# EAGLE design minM3car (EAGLE 9.4.2)
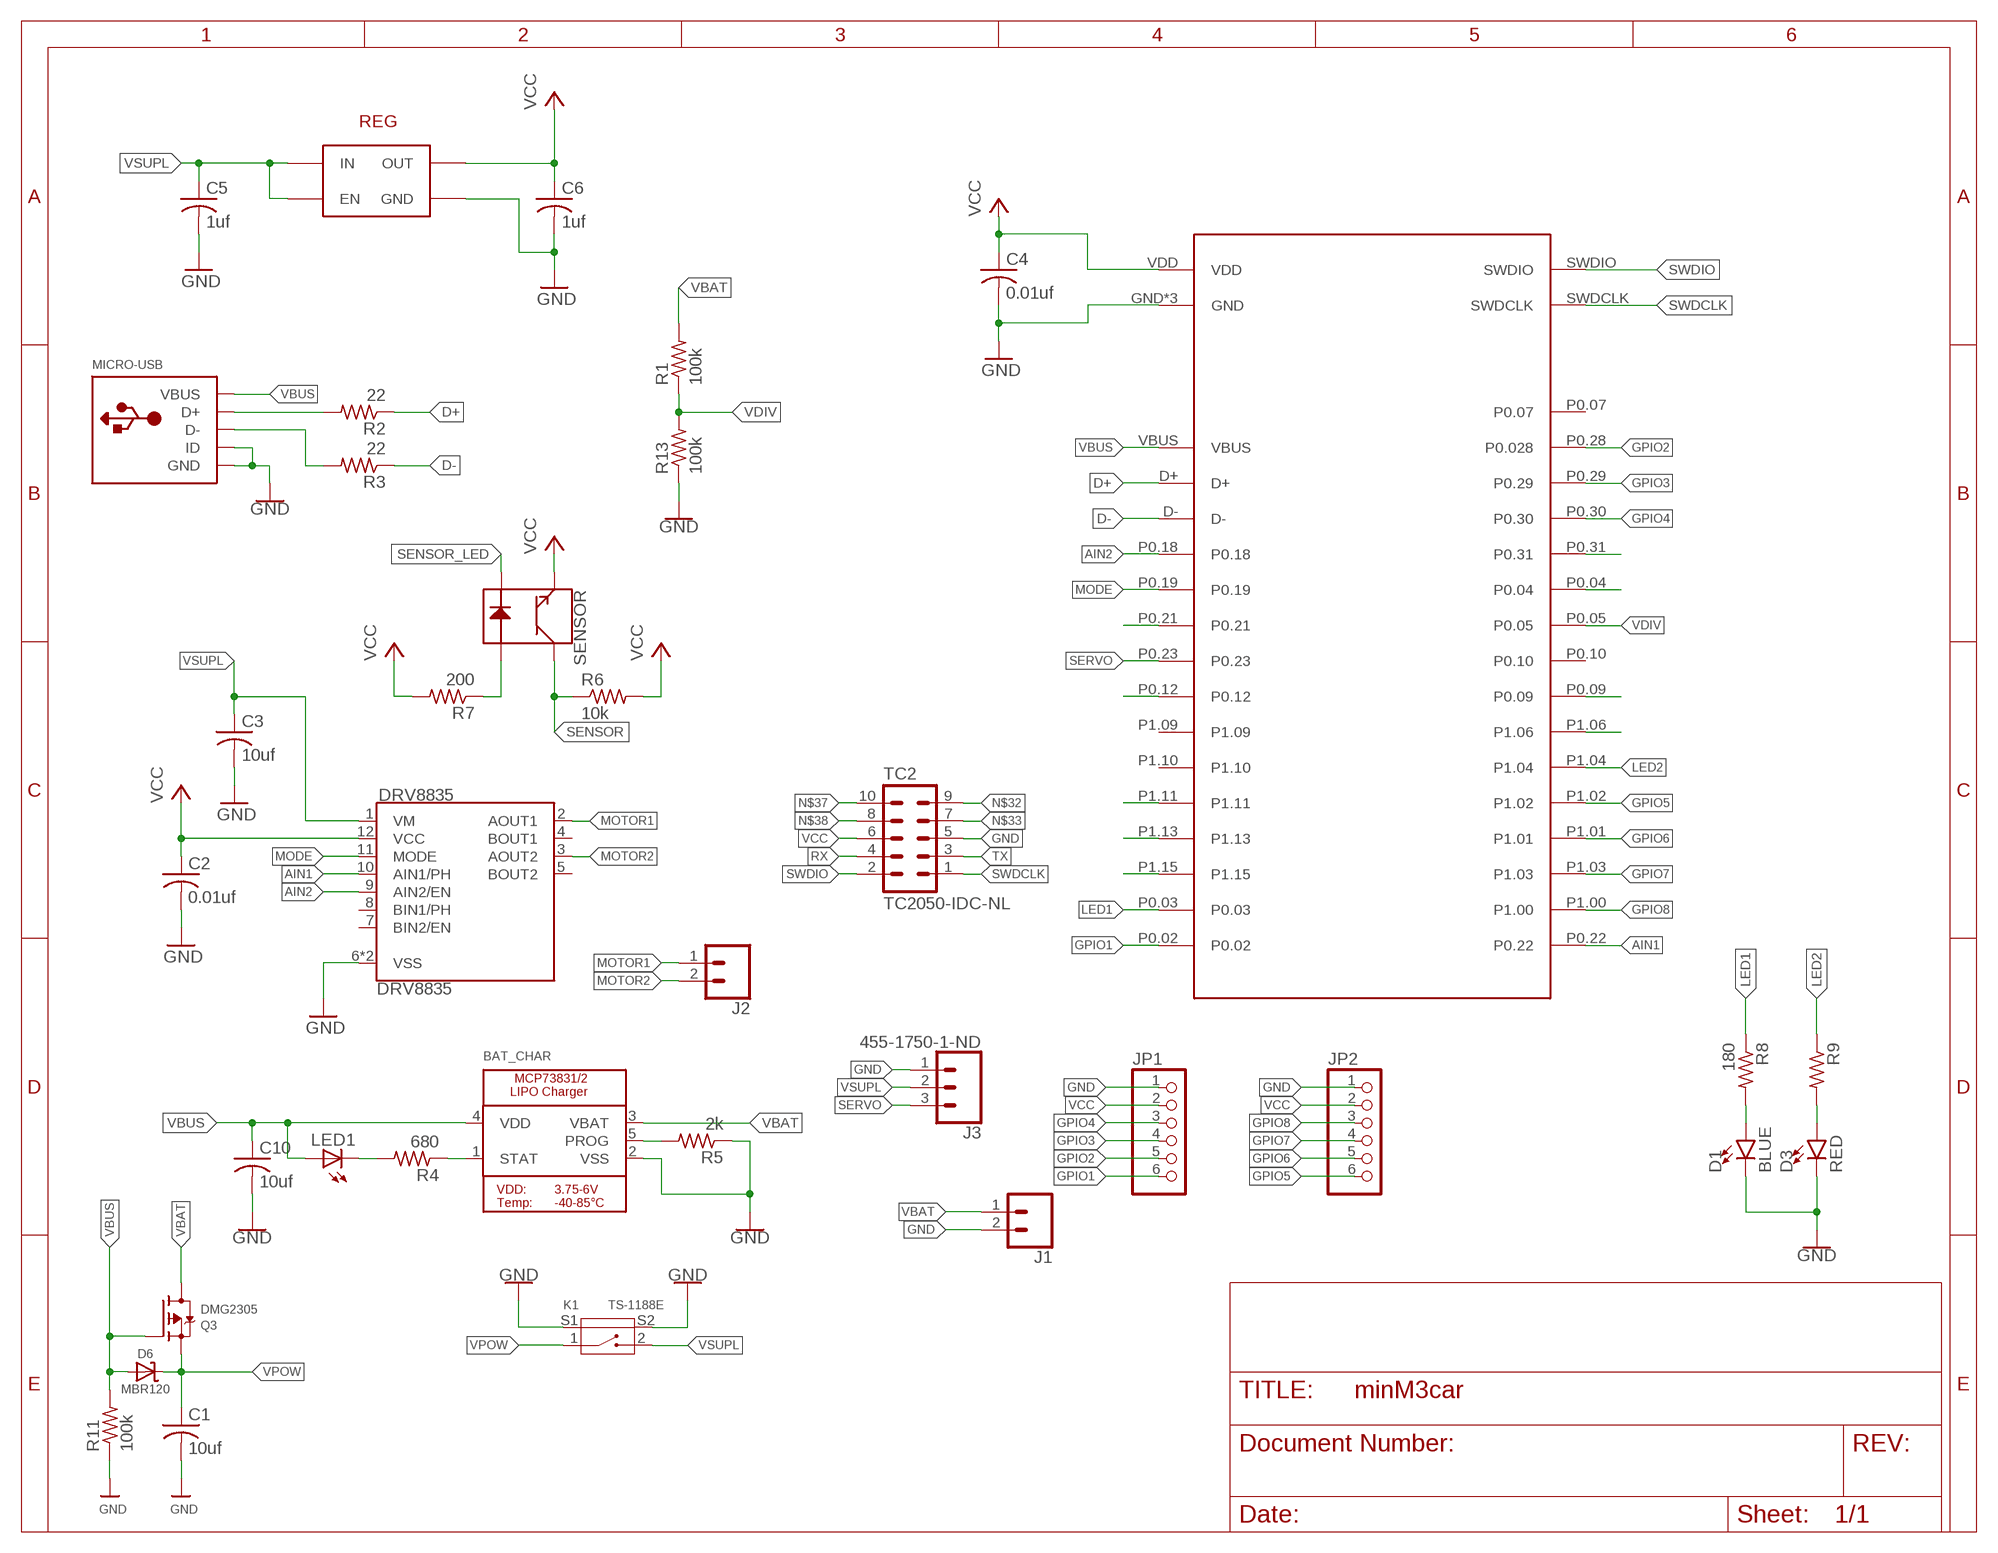
[diagram p0: schematic, sheet 1]

## Parts
BAT_CHAR  MICROBUILDER_MCP73831/2  [MICROBUILDER_SOT23-5]
C1  10uf  C-USC0402  [C0402]
C2  0.01uf  C-USC0402  [C0402]
C3  10uf  C-USC0402  [C0402]
C4  0.01uf  C-USC0402  [C0402]
C5  1uf  C-USC0402  [C0402]
C6  1uf  C-USC0402  [C0402]
C10  10uf  C-USC0402  [C0402]
D1  BLUE  LED-BLUE0603  [LED-0603]
D3  RED  LED-RED0603  [LED-0603]
D6  MBR120  DIODE-SCHOTTKYSOD-123  [SOD-123]
DRV8835  DRV8835  DRV883X  [WSON-12]
J1  CONN_02  [1X02]
J2  CONN_02  [1X02]
J3  455-1750-1-ND  CONN_03  [1X03]
JP1  PINHD-1X6  [1X06]
JP2  PINHD-1X6  [1X06]
K1  TS-1188E  SMD-BUTTON(2+2P-7X3.5MM-90D)  [SW4-SMD-7.0X3.5X3.5MM-90D]
LED1  LEDCHIPLED_0603  [CHIPLED_0603]
MICRO-USB  MICROBUILDER_USB_MICRO_20329_V2  [MICROBUILDER_4UCONN_20329_V2]
NRF52  HOLYIOT  [HOLYIOT]
Q3  DMG2305  MOSFET-P  [SOT23-R]
R1  100k  R-US_R0402  [R0402]
R2  22  R-US_R0402  [R0402]
R3  22  R-US_R0402  [R0402]
R4  680  R-US_R0402  [R0402]
R5  2k  R-US_R0402  [R0402]
R6  10k  R-US_R0402  [R0402]
R7  200  R-US_R0402  [R0402]
R8  180  R-US_R0402  [R0402]
R9  180  R-US_R0402  [R0402]
R11  100k  R-US_R0402  [R0402]
R13  100k  R-US_R0402  [R0402]
REG  TLV703  [SOT95P285X120-5N]
SENSOR  QRE1113SMD-W  [QRE1113-W]
TC2  TC2050-IDC-NL  [TC2050-IDC-NL]

## Nets
AIN1: DRV8835.10(AIN1/PH) NRF52.P0.22
AIN2: DRV8835.9(AIN2/EN) NRF52.P0.18
D+: NRF52.D+ R2.1
D-: NRF52.D- R3.1
GND: BAT_CHAR.2(VSS) C1.2 C2.2 C3.2 C4.2 C5.2 C6.2 C10.2 D1.C D3.C DRV8835.6(VSS) DRV8835.PAD(VSS) J1.2 J3.1 JP1.1 JP2.1 K1.S1 K1.S2 MICRO-USB.BASE@1(GND) MICRO-USB.BASE@2(GND) MICRO-USB.GND MICRO-USB.ID MICRO-USB.SPRT@1(GND) MICRO-USB.SPRT@2(GND) MICRO-USB.SPRT@3(GND) MICRO-USB.SPRT@4(GND) NRF52.GND NRF52.GND2(GND) NRF52.GND3(GND) R5.1 R11.1 R13.1 REG.2(GND) TC2.5
GPIO1: JP1.6 NRF52.P0.02
GPIO2: JP1.5 NRF52.P0.28(P0.028)
GPIO3: JP1.4 NRF52.P0.29
GPIO4: JP1.3 NRF52.P0.30
GPIO5: JP2.6 NRF52.P1.02
GPIO6: JP2.5 NRF52.P1.01
GPIO7: JP2.4 NRF52.P1.03
GPIO8: JP2.3 NRF52.P1.00
LED1: NRF52.P0.03 R8.1
LED2: NRF52.P1.04 R9.1
MODE: DRV8835.11(MODE) NRF52.P0.19
MOTOR1: DRV8835.2(AOUT1) J2.1
MOTOR2: DRV8835.3(AOUT2) J2.2
N$1: D1.A R8.2
N$2: LED1.C R4.2
N$3: D3.A R9.2
N$4 [POWER]: NRF52.P0.21
N$6: NRF52.P0.12
N$7 [POWER]: NRF52.P0.09
N$8: MICRO-USB.D+ R2.2
N$9: MICRO-USB.D- R3.2
N$10 [POWER]: NRF52.P1.06
N$15: R7.1 SENSOR.1(A)
N$19 [POWER]: NRF52.P1.15
N$20: BAT_CHAR.5(PROG) R5.2
N$21: BAT_CHAR.1(STAT) R4.1
N$22 [POWER]: NRF52.P1.13
N$23 [POWER]: NRF52.P1.11
N$27 [POWER]: NRF52.P0.04
N$30 [POWER]: NRF52.P0.31
N$32: TC2.9
N$33: TC2.7
N$37: TC2.10
N$38: TC2.8
RX: TC2.4
SENSOR: R6.1 SENSOR.3(C)
SENSOR_LED: SENSOR.2(K)
SERVO: J3.3 NRF52.P0.23
SWDCLK: NRF52.SWDCLK TC2.1
SWDIO: NRF52.SWDIO TC2.2
TX: TC2.3
VBAT [POWER]: BAT_CHAR.3(VBAT) J1.1 Q3.3(D) R1.2
VBUS [POWER]: BAT_CHAR.4(VDD) C10.1 D6.A LED1.A MICRO-USB.VBUS NRF52.VBUS Q3.1(G) R11.2
VCC [3.3V]: C2.1 C4.1 C6.1 DRV8835.12(VCC) JP1.2 JP2.2 NRF52.VDD R6.2 R7.2 REG.5(OUT) SENSOR.4(E) TC2.6
VDIV: NRF52.P0.05 R1.1 R13.2
VPOW: C1.1 D6.C K1.1 Q3.2(S)
VSUPL [POWER]: C3.1 C5.1 DRV8835.1(VM) J3.2 K1.2 REG.1(IN) REG.3(EN)
Unconnected: DRV8835.4(BOUT1) DRV8835.5(BOUT2) DRV8835.7(BIN2/EN) DRV8835.8(BIN1/PH) NRF52.P0.07 NRF52.P0.10 NRF52.P1.09 NRF52.P1.10

## Library data of the parts
BAT_CHAR = Adafruit Feather 32u4 RFMxx:MICROBUILDER_MCP73831/2: MCP73831/2 LIPO Charger VDD: 3.75 - 6V Temp -40 - 85°C Programmable Charge Rate: 15-500mA NOTE: STAT is a tri-state logic output on the MCP73831 and an open-drain output on the MCP73832. SOT23-5 with 4.2V output and tri-state logic on STAT = MCP73831T-2ACI/OT; LINK: https://uy.mouser.com/ProductDetail/Microchip-Technology/MCP73831T-2ACI-OT?qs=sGAEpiMZZMtLck3p7ZBovc%252BIEf4wKPGR; MPN: MCP73831T-2ACI/OT
C1 C3 C10 = adafruit:C-US: CAPACITOR, American symbol; MPN: GRM155R60G106ME44D
C2 C4 = adafruit:C-US: CAPACITOR, American symbol; MPN: CL05C100JB5NNNC
C5 C6 = adafruit:C-US: CAPACITOR, American symbol; MPN: CL05A105KP5NNNC
D1 = SparkFun-LED:LED-BLUE: Blue SMD LED Used in manufacturing of various products at SparkFun Packages: 0603 - SMD 0603 package [Product Link] <http://www.digikey.com/product-detail/en/SMLE12BC7TT86/511-1589-2-ND/1641808> 1206 - SMD1206 package [Product Link] <http://www.digikey.com/product-detail/en/lite-on-inc/LTST-C150TBKT/160-1643-1-ND/573584> SparkFun Products: ESP8266 Thing-Dev Board <https://www.sparkfun.com/products/13711> RedBoard <https://www.sparkfun.com/products/12757>; MPN: 150060YS75000; PROD_ID: DIO-08575
D3 = SparkFun-LED:LED-RED: Red SMD LED Used in manufacturing of most products at SparkFun Packages: 0603 - SMD 0603 package [Product Link] <http://docs.avagotech.com/docs/AV02-0551EN> 0603 SMART - SMD 0603 SMART package ( more efficient and expensive)[Product Link] <http://www.osram-os.com/Graphics/XPic2/00077099_0.pdf> 1206 - SMD1206 package [Product Link] <https://www.sparkfun.com/datasheets/DevTools/LilyPad/Q150OVS4.pdff> SparkFun Products: Pro Mini 328 -5V <https://www.sparkfun.com/products/821> RedBoard <https://www.sparkfun.com/products/12757> IOIO-OTG <https://www.sparkfun.com/products/13613>; MPN: 150060YS75000; PROD_ID: DIO-00819
D6 = microbuilder:DIODE-SCHOTTKY; MPN: MBR120VLSFT3G
DRV8835 = SparkFun-IC-Special-Function:DRV883X: DRV8835 2 Channel Motor Driver Dual 1.5A H-bridge, 2-11V Datasheet <http://www.ti.com/lit/ds/symlink/drv8835.pdf> SparkFun Products: SparkFun Serial Controlled Motor Driver <https://www.sparkfun.com/products/13911>; LINK: https://uy.mouser.com/ProductDetail/Texas-Instruments/DRV8835DSSR?qs=sGAEpiMZZMsLzCkzIJTB61U4TTU%252BM%252BAY; MPN: DRV8835DSSR; PROD_ID: IC-13342
J1 J2 = SparkFun-Connectors:CONN_02: Multi connection point. Often used as Generic Header-pin footprint for 0.1 inch spaced/style header connections On any of the 0.1 inch spaced packages, you can populate with these: Break Away Headers - Straight <https://www.sparkfun.com/products/116> (PRT-00116) Break Away Male Headers - Right Angle <https://www.sparkfun.com/products/553> (PRT-00553) Female Headers <https://www.sparkfun.com/products/115> (PRT-00115) Break Away Headers - Machine Pin <https://www.sparkfun.com/products/117> (PRT-00117) Break Away Female Headers - Swiss Machine Pin <https://www.sparkfun.com/products/743> (PRT-00743) For SCREWTERMINALS and SPRING TERMINALS visit here: Screw Terimnals on SparkFun.com <https://www.sparkfun.com/search/results?term=Screw+Terminals> (5mm/3.5mm/2.54mm spacing) This device is also useful as a general connection point to wire up your design to another part of your project. Our various solder wires solder well into these plated through hole pads. Hook-Up Wire - Assortment (Stranded, 22 AWG) <https://www.sparkfun.com/products/11375> (PRT-11375) Hook-Up Wire - Assortment (Solid Core, 22 AWG) <https://www.sparkfun.com/products/11367> (PRT-11367) View the entire wire category on our website here <https://www.sparkfun.com/categories/141> Special notes: Molex polarized connector foot print use with: PRT-08233 with associated crimp pins and housings. 2.54_SCREWTERM for use with PRT-10571. 3.5mm Screw Terminal footprints for PRT-08084 5mm Screw Terminal footprints for use with PRT-08432
J3 = SparkFun-Connectors:CONN_03: Multi connection point. Often used as Generic Header-pin footprint for 0.1 inch spaced/style header connections On any of the 0.1 inch spaced packages, you can populate with these: Break Away Headers - Straight <https://www.sparkfun.com/products/116> (PRT-00116) Break Away Male Headers - Right Angle <https://www.sparkfun.com/products/553> (PRT-00553) Female Headers <https://www.sparkfun.com/products/115> (PRT-00115) Break Away Headers - Machine Pin <https://www.sparkfun.com/products/117> (PRT-00117) Break Away Female Headers - Swiss Machine Pin <https://www.sparkfun.com/products/743> (PRT-00743) Stackable Header - 3 Pin (Female, 0.1") <https://www.sparkfun.com/products/13875> (PRT-13875) For SCREWTERMINALS and SPRING TERMINALS visit here: Screw Terimnals on SparkFun.com <https://www.sparkfun.com/search/results?term=Screw+Terminals> (5mm/3.5mm/2.54mm spacing) This device is also useful as a general connection point to wire up your design to another part of your project. Our various solder wires solder well into these plated through hole pads. Hook-Up Wire - Assortment (Stranded, 22 AWG) <https://www.sparkfun.com/products/11375> (PRT-11375) Hook-Up Wire - Assortment (Solid Core, 22 AWG) <https://www.sparkfun.com/products/11367> (PRT-11367) View the entire wire category on our website here <https://www.sparkfun.com/categories/141> Special notes: Molex polarized connector foot print use with SKU : PRT-08232 with associated crimp pins and housings.; PROD_ID: XXX-00000
JP1 JP2 = adafruit:PINHD-1X6: PIN HEADER
K1 = OPL_Switch:SMD-BUTTON(2+2P-7X3.5MM-90D): 311020023; MPN: TS-1188E
LED1 = adafruit:LED: LED OSRAM: - CHIPLED LG R971, LG N971, LY N971, LG Q971, LY Q971, LO R971, LY R971 LH N974, LH R974 LS Q976, LO Q976, LY Q976 LO Q996 - Hyper CHIPLED LW Q18S LB Q993, LB Q99A, LB R99A - SideLED LS A670, LO A670, LY A670, LG A670, LP A670 LB A673, LV A673, LT A673, LW A673 LH A674 LY A675 LS A676, LA A676, LO A676, LY A676, LW A676 LS A679, LY A679, LG A679 - Hyper Micro SIDELED® LS Y876, LA Y876, LO Y876, LY Y876 LT Y87S - SmartLED LW L88C, LW L88S LB L89C, LB L89S, LG L890 LS L89K, LO L89K, LY L89K LS L896, LA L896, LO L896, LY L896 - TOPLED LS T670, LO T670, LY T670, LG T670, LP T670 LSG T670, LSP T670, LSY T670, LOP T670, LYG T670 LG T671, LOG T671, LSG T671 LB T673, LV T673, LT T673, LW T673 LH T674 LS T676, LA T676, LO T676, LY T676, LB T676, LH T676, LSB T676, LW T676 LB T67C, LV T67C, LT T67C, LS T67K, LO T67K, LY T67K, LW E67C LS E67B, LA E67B, LO E67B, LY E67B, LB E67C, LV E67C, LT E67C LW T67C LS T679, LY T679, LG T679 LS T770, LO T770, LY T770, LG T770, LP T770 LB T773, LV T773, LT T773, LW T773 LH T774 LS E675, LA E675, LY E675, LS T675 LS T776, LA T776, LO T776, LY T776, LB T776 LHGB T686 LT T68C, LB T68C - Hyper Mini TOPLED® LB M676 - Mini TOPLED Santana® LG M470 LS M47K, LO M47K, LY M47K Source: http://www.osram.convergy.de/; MPN: 150060GS75000
MICRO-USB = Adafruit Feather 32u4 RFMxx:MICROBUILDER_USB: USB Connectors USBMINIB - Surface Mount Female Mini-B USB Connector 4UConnector: 06564; LINK: https://www.digikey.com/product-detail/en/amphenol-icc-fci/10103592-0001LF/609-4048-1-ND/2350355; MPN: 10103592-0001LF
NRF52 = holyiot:HOLYIOT; MPN: 113990556
Q3 = microbuilder:MOSFET-P: P-Channel Mosfet LEGEND VDS: Voltage Drain-Source ID: Drain Current RDS(ON): Drain-Source On-State Resistance VGS(TH): Gate-Source Threshold Voltage CISS: Drain-Source Input Capacitance SOT-23 Name VDS ID RDS(ON) VGS(TH) CISS Order Number IRLML5103 30V 760mA 600 mOhm -- 75pF @ 25V Digikey: IRLML5103PBFCT-ND IRLML6401 12V 4.3A 50 mOhm 950mV @ 250µA 830pF @ 10V Digikey: IRLML6401PBFTR-ND NTR0202PL 20V 400mA 800 mOhm 2.3V @ 250uA 70pF @ 5V Digikey: NTR0202PLT1GOSTR-ND NTR4101PT1G 20V 1.8A 85 mOhm 1.2V @ 250uA 675pF @ 10V Digikey: NTR4101PT1GOSCT-ND DMP2004K 20V 600mA 900 mOhm 1V @ 250uA 175pF @ 16V Digikey: DMP2004KDICT-ND PMV65XP 20V 3.9A 76 mOhm 950mV @ 1mA 725pF @ 20V Digikey: 568-2358-2-ND TO-252 Name VDS ID RDS(ON) VGS(TH) CISS Order Number AOD417 30V 25A 34 mOhm 3V @ 250µA 920pF @ 15V Digikey: 785-1106-2-ND PowerPak Name VDS ID RDS(ON) VGS(TH) CISS Order Number AON7401 30V 12A 14 mOhm 3V @ 250µA 2600pF @ 15V Digikey: 785-1302-1-ND; MPN: DMG2305UXQ-7
R1 R11 R13 = adafruit:R-US_: RESISTOR, American symbol; MPN: RC0402JR-07100KL
R2 R3 = adafruit:R-US_: RESISTOR, American symbol; LINK: https://www.seeedstudio.com/opl.html; MPN: BLM15BB220SN1D
R4 = adafruit:R-US_: RESISTOR, American symbol; LINK: https://www.seeedstudio.com/opl.html; MPN: RC0402JR-07680RL
R5 = adafruit:R-US_: RESISTOR, American symbol; MPN: RC0402FR-072KL
R6 = adafruit:R-US_: RESISTOR, American symbol; LINK: https://www.seeedstudio.com/opl.html; MPN: RC0402JR-0710KL
R7 = adafruit:R-US_: RESISTOR, American symbol; MPN: 0402WGF2000TCE
R8 R9 = adafruit:R-US_: RESISTOR, American symbol; LINK: https://www.seeedstudio.com/opl.html; MPN: RC0402FR-07180RL
REG = SOT95P285X120-5N:TLV703; LINK: https://uy.mouser.com/ProductDetail/Texas-Instruments/TLV7031DBVR?qs=sGAEpiMZZMutXGli8Ay4kO1LHQwdKe7AZqBYpoPj%2FWg%3D; MPN: TLV7031DBVR
SENSOR = SparkFun-Sensors:QRE1113: QRE1113 Reflective Object Sensor The QRE1113 is a small IR reflectance sensor. This sensor is often used in line following robots because, if it can sense if a surface is white or black. There are four pins on the QRE1113 - two control the IR emitting LED while the other two are the collector and emitter of a phototransistor. The IR diode has a max forward current of 50mA and operates at 940nm. Datasheet <http://www.sparkfun.com/datasheets/Components/SMD/QRE1113.GR.pdf> SparkFun Products IR Reflectance Sensor - QRE1113 <https://www.sparkfun.com/products/9542> (COM-09542) SparkFun Line Sensor Breakout - QRE1113 (Analog) <https://www.sparkfun.com/products/9453> (ROB-09453) SparkFun Line Sensor Breakout - QRE1113 (Digital) <https://www.sparkfun.com/products/9454> (ROB-09454) SparkFun RedBot Sensor - Line Follower <https://www.sparkfun.com/products/11769> (SEN-11769) SparkFun RedBot Sensor - Wheel Encoder <https://www.sparkfun.com/products/12617> (SEN-12617) SparkFun Line Follower Array <https://www.sparkfun.com/products/13582> (SEN-13582); LINK: https://uy.mouser.com/ProductDetail/ON-Semiconductor-Fairchild/QRE1113GR?qs=sGAEpiMZZMt82OzCyDsLFF3rmybX%252BxhMzW1DivtsctQ%3D; MPN: QRE1113GR; PROD_ID: IC-09357; SF_ID: COM-09542
TC2 = TagConnect:TC2050-IDC: Tag-Connect In Circuit Programming & Debug Cable 10 Pin http://www.tag-connect.com

## Net classes
1 POWER: width 0.4 mm
2 3.3V: width 0.3 mm

## Board
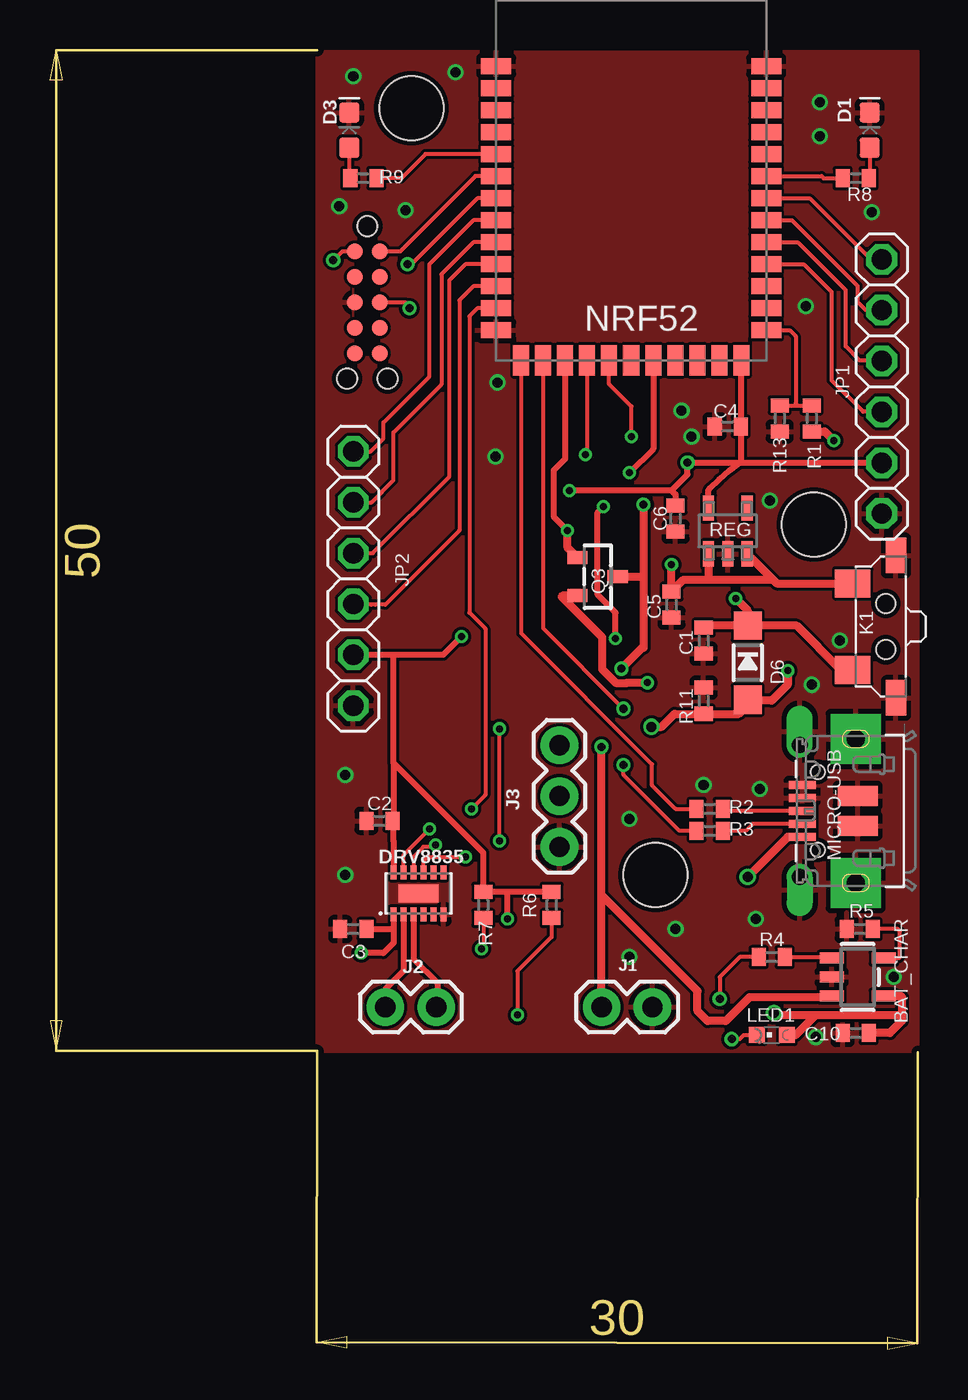
[diagram p1: board, top side]
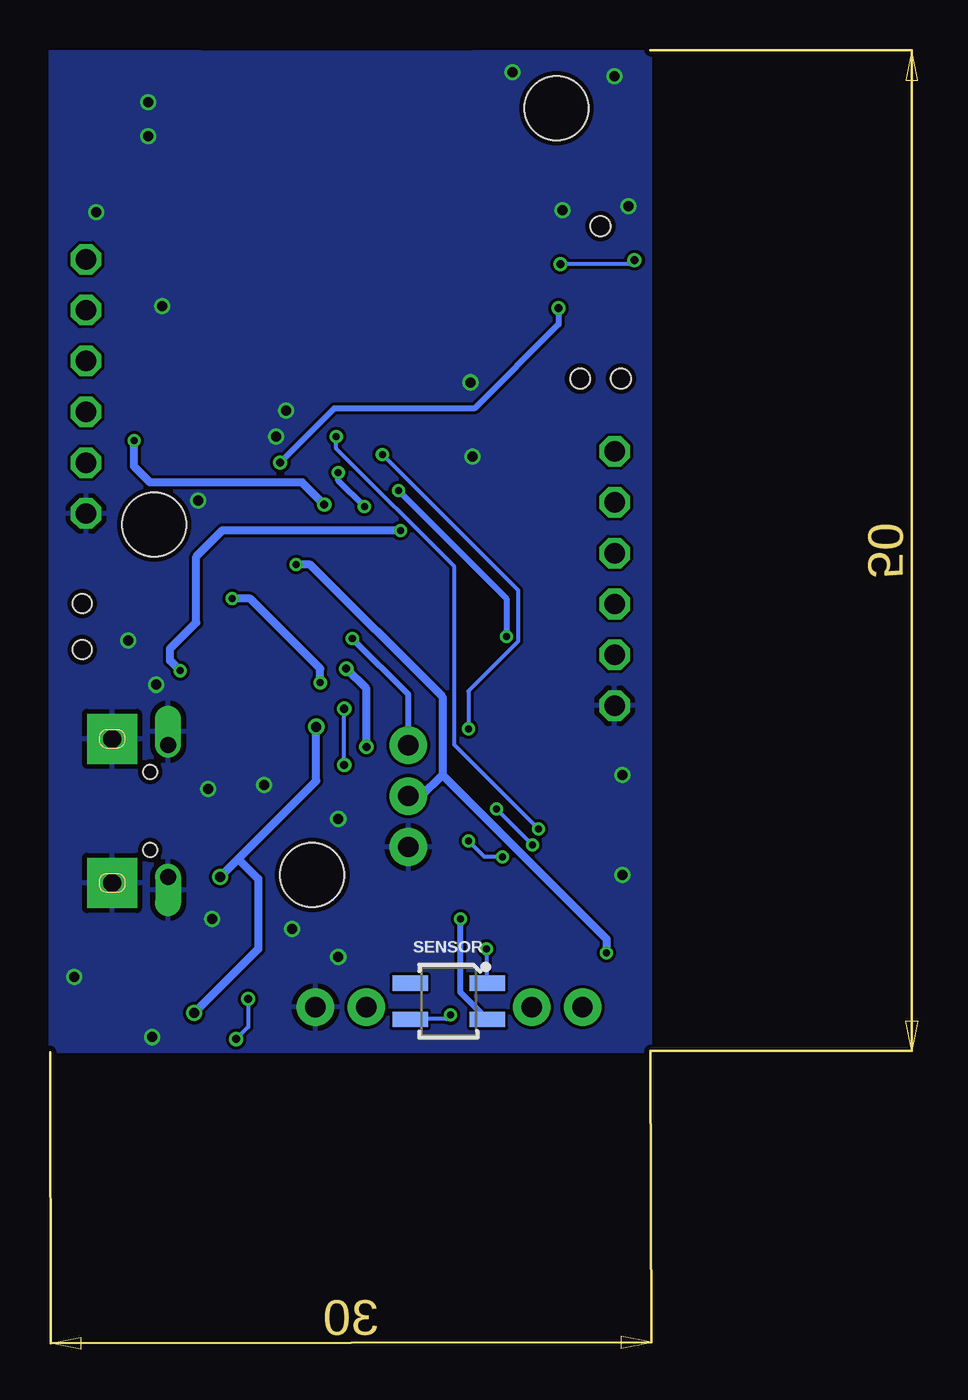
[diagram p2: board, bottom side, seen from below]

Size 1.31 x 8.1 mm. Coordinates in mm from the lower left corner, seen from the top.
Copper layers (1*16): Top 0.035mm / dielectric 1.5mm / Bottom 0.035mm
Design rules "SeeedStudio_2layer_DRU_no_angle_20140221": minimum track width 6mil, minimum drill 12mil, track to track 6mil, track to pad 6mil, pad to pad 6mil, via to via 6mil, smd to smd 0mil, copper to edge 10mil, drill to drill 10mil, minimum pad ring 10mil, minimum via ring 6mil, stop-mask expansion 2mil, vias tented up to drill 100mil, thermal gap 10mil
Holes 3.2 mm at -21.55,39.15 -9.35,0.85 -1.45,18.35

### Footprints (pad centres in the part's own frame; a part is rotated, then mirrored left to right if it is on the bottom)
MICROBUILDER_SOT23-5 = smd 0.55 x 1.2: 1 -0.95,-1.3; 2 0,-1.3; 3 0.95,-1.3; 4 0.95,1.3; 5 -0.95,1.3
C0402 = smd 0.7 x 0.9: 1 -0.65,0; 2 0.65,0
LED-0603 = smd 1 x 1: A -0.877,0; C 0.877,0
SOD-123 = smd 1.4 x 1.4: A 1.85,0; C -1.85,0
WSON-12 = smd 0.3 x 0.7: 1 -1.25,-1.05; 2 -0.75,-1.05; 3 -0.25,-1.05; 4 0.25,-1.05; 5 0.75,-1.05; 6 1.25,-1.05; 7 1.25,1.05; 8 0.75,1.05; 9 0.25,1.05; 10 -0.25,1.05; 11 -0.75,1.05; 12 -1.25,1.05 | smd 2 x 0.9: PAD 0,0
1X02 = drill 1.016 pad 1.88: 1 0,0; 2 2.54,0
1X03 = drill 1.016 pad 1.88: 1 0,0; 2 2.54,0; 3 5.08,0
1X06 = drill 1.016 octagon: 1 -6.35,0; 2 -3.81,0; 3 -1.27,0; 4 1.27,0; 5 3.81,0; 6 6.35,0
SW4-SMD-7.0X3.5X3.5MM-90D = smd 1.397 x 1.778: 1 -2.159,1.651; 2 2.159,1.651 | smd 1.778 x 1.016: S1 -3.556,-0.508; S2 3.556,-0.508 | hole 0.95: -1.15,0; 1.15,0
CHIPLED_0603 = smd 0.8 x 0.8: A 0,-0.75; C 0,0.75
MICROBUILDER_4UCONN_20329_V2 = smd 1 x 2: BASE@1 -0.75,-2; BASE@2 0.75,-2 | smd 0.4 x 1.35: D+ 0,0.775; D- -0.65,0.775; GND 1.3,0.775; ID 0.65,0.775; VBUS -1.3,0.775 | drill 0.8 pad 1.2 offset: SPRT@1 -3.3,0.9; SPRT@2 3.3,0.9 | drill 0.9 pad 2.5 square: SPRT@3 -3.6,-1.9; SPRT@4 3.6,-1.9 | hole 0.7: -1.95,0; 1.95,0
HOLYIOT = smd 0.8 x 1.5: D+ -5.5,0; D- -4.4,0; P0.07 4.4,0; P0.12 2.2,0; P0.18 -2.2,0; P0.19 -1.1,0; P0.21 0,0; P0.23 1.1,0; P1.09 3.3,0; VBUS -3.3,0; VDD 5.5,0 | smd 1.5 x 0.8: GND 6.75,14.7; GND2 -6.75,14.7; GND3 -6.75,1.5; P0.02 6.75,8.1; P0.03 6.75,9.2; P0.04 6.75,2.6; P0.05 6.75,1.5; P0.09 -6.75,12.5; P0.10 -6.75,13.6; P0.22 -6.75,2.6; P0.28 6.75,7; P0.29 6.75,5.9; P0.30 6.75,4.8; P0.31 6.75,3.7; P1.00 -6.75,3.7; P1.01 -6.75,5.9; P1.02 -6.75,7; P1.03 -6.75,4.8; P1.04 -6.75,10.3; P1.06 -6.75,11.4; P1.10 6.75,13.6; P1.11 6.75,12.5; P1.13 6.75,11.4; P1.15 6.75,10.3; SWDCLK -6.75,8.1; SWDIO -6.75,9.2
SOT23-R = smd 0.635 x 1.016: 1 -0.95,-1; 2 0.95,-1; 3 0,1
R0402 = smd 0.7 x 0.9: 1 -0.65,0; 2 0.65,0
SOT95P285X120-5N = smd 1.27 x 0.559: 1 -1.143,0.965; 2 -1.143,0; 3 -1.143,-0.965; 4 1.143,-0.965; 5 1.143,0.965
QRE1113-W = smd 1.778 x 0.762: 1 -1.927,-0.9; 2 1.927,-0.9; 3 1.927,0.9; 4 -1.927,0.9
TC2050-IDC-NL = smd 0.787 x 0.787: 1 -2.54,-0.635; 2 -2.54,0.635; 3 -1.27,-0.635; 4 -1.27,0.635; 5 0,-0.635; 6 0,0.635; 7 1.27,-0.635; 8 1.27,0.635; 9 2.54,-0.635; 10 2.54,0.635 | hole 0.991: -3.81,0; 3.81,1.016; 3.81,-1.016

### Placement (x,y rotation side)
BAT_CHAR  0.75,-4.25 270 top  (outside the outline)
C1  -6.95,12.55 270 top  (outside the outline)
C2  -23.15,3.55 180 top  (outside the outline)
C3  -24.45,-1.85 180 top  (outside the outline)
C4  -5.75,23.25 180 top  (outside the outline)
C5  -8.55,14.35 270 top  (outside the outline)
C6  -8.35,18.65 270 top  (outside the outline)
C10  0.65,-7.05 180 top  (outside the outline)
D1  1.35,38.05 90 top  (outside the outline)
D3  -24.65,38.05 90 top  (outside the outline)
D6  -4.75,11.45 270 top  (outside the outline)
DRV8835  -21.19,-0.07 0 top  (outside the outline)
J1  -12.05,-5.75 0 top  (outside the outline)
J2  -22.85,-5.75 0 top  (outside the outline)
J3  -14.15,2.25 90 top  (outside the outline)
JP1  1.95,25.25 90 top  (outside the outline)
JP2  -24.45,15.65 90 top  (outside the outline)
K1  2.15,13.25 90 top
LED1  -3.55,-7.15 90 top  (outside the outline)
MICRO-USB  -1.25,4.05 90 top
NRF52  -10.57,26.55 0 top  (outside the outline)
Q3  -12.25,15.75 270 top  (outside the outline)
R1  -1.55,23.65 270 top  (outside the outline)
R2  -6.65,4.15 0 top  (outside the outline)
R3  -6.65,3.05 0 top  (outside the outline)
R4  -3.55,-3.25 180 top  (outside the outline)
R5  0.85,-1.85 0 top
R6  -14.55,-0.65 90 top  (outside the outline)
R7  -17.95,-0.65 90 top  (outside the outline)
R8  0.65,35.65 0 top  (outside the outline)
R9  -23.95,35.65 180 top  (outside the outline)
R11  -6.95,9.55 270 top  (outside the outline)
R13  -3.15,23.65 90 top  (outside the outline)
REG  -5.74,18.03 90 top  (outside the outline)
SENSOR  -16.17,-5.46 180 bottom  (outside the outline)
TC2  -23.75,29.45 270 top  (outside the outline)

### Tracks (layer width: path | path; a pad name or v marks a point on that pad's centre or on a via)
AIN1  (via drill 0.35)
  Top 0.2: NRF52.P0.22 -18.25,29.15 -18.65,28.75 -18.65,13.95 -17.85,13.15 -17.85,4.85 v-18.55,4.15 | v-20.35,2.34 -20.44,2.25 -20.95,2.25 -21.45,1.75 DRV8835.10
  Bottom 0.2: v-18.55,4.15 v-20.35,2.35 v-20.35,2.34
AIN2  (via drill 0.35)
  Top 0.2: NRF52.P0.18 -12.77,21.93 v-12.85,21.85 | DRV8835.9 -20.95,1.55 -20.75,1.75 v-18.85,1.75 | v-17.15,2.55 v-17.15,8.15
  Bottom 0.2: v-17.15,8.15 -17.15,10.03 -19.63,12.51 -19.63,15.07 v-12.85,21.85 | v-18.85,1.75 -17.95,1.75 v-17.15,2.55
D+
  Top 0.2: R2.1 -8.35,4.15 -9.52,5.33 -9.52,6.38 -16.07,12.92 NRF52.D+
D-  (via drill 0.4)
  Top 0.2: R3.1 -8.15,3.05 -10.95,5.85 v-10.95,6.35 | v-10.95,9.15 -14.97,13.17 NRF52.D-
  Bottom 0.2: v-10.95,6.35 v-10.95,9.15
GND  (via drill 0.5)
  other vias: -1.35,-7.25 -8.05,24.05 -7.55,22.75 -24.45,40.75 -17.25,25.45 -21.85,34.05 -25.15,34.25 -1.85,29.25 1.45,33.95 -1.55,10.35 -0.15,12.55 -10.65,3.65 -8.35,-1.85 -24.85,5.85 -24.85,0.85 -10.65,-3.25 -4.35,-1.35 2.55,-4.25 -1.15,39.45 -1.15,37.75 -19.35,40.95 -3.65,19.55 -6.95,5.35 -4.15,5.15 -17.35,21.75
  pour Top: -26.25,-7.95 3.75,-7.95 3.75,41.95 -26.25,41.95
  pour Bottom: 3.75,-7.95 -26.25,-7.95 -26.25,41.95 3.75,41.95
GPIO1
  Top 0.2: JP1.6 1.4,31.6 -1.65,34.65 NRF52.P0.02
GPIO2
  Top 0.2: JP1.5 1.14,29.06 0.75,29.45 0.75,30.26 -2.54,33.55 NRF52.P0.28
GPIO3
  Top 0.2: JP1.4 1.92,26.55 0.85,26.55 0.15,27.25 0.15,30.05 -2.25,32.45 NRF52.P0.29
GPIO4
  Top 0.2: JP1.3 1.02,23.98 -0.55,25.55 -0.55,29.95 -1.95,31.35 NRF52.P0.30
GPIO5
  Top 0.2: NRF52.P1.02 -18.45,33.55 -20.65,31.35 -20.65,25.75 -22.95,23.45 -22.95,22.65 -23.6,22 JP2.6
GPIO6
  Top 0.2: NRF52.P1.01 -18.45,32.45 -20.05,30.85 -20.05,25.35 -22.45,22.95 -22.45,20.56 -23.55,19.46 JP2.5
GPIO7
  Top 0.2: NRF52.P1.03 -18.85,31.35 -19.65,30.55 -19.65,20.75 -23.48,16.92 JP2.4
GPIO8
  Top 0.2: NRF52.P1.00 -18.45,30.25 -19.15,29.55 -19.15,18.05 -22.85,14.35 -23.35,14.35 -23.55,14.35 -24.42,14.35 JP2.3
LED1
  Top 0.2: NRF52.P0.03 -1.05,35.75 -0.95,35.65 R8.1
LED2
  Top 0.2: NRF52.P1.04 -20.85,36.85 -22.05,35.65 R9.1
MODE  (via drill 0.35)
  Top 0.2: DRV8835.11 -21.94,1.86 v-20.65,3.15 | v-10.55,22.75 -10.55,24.25 -11.67,25.37 NRF52.P0.19
  Bottom 0.2: v-20.65,3.15 -16.45,7.35 -16.45,16.25 -10.55,22.15 v-10.55,22.75
MOTOR1
  Top 0.3: J2.1 -22.85,-4.85 -21.94,-3.94 DRV8835.2
MOTOR2
  Top 0.2: -20.25,-5.69 J2.2
  Top 0.3: -20.25,-5.69 -20.25,-4.55 -21.44,-3.36 DRV8835.3
N$1
  Top 0.2: D1.A 1.35,35.7 R8.2
N$2  (via drill 0.4)
  Top 0.2: v-5.55,-7.35 -5.15,-7.35 -4.95,-7.15 LED1.C | R4.2 -5.15,-3.25 -6.15,-4.25 v-6.15,-5.35
  Bottom 0.2: v-6.15,-5.35 -6.15,-6.75 v-5.55,-7.35
N$3
  Top 0.2: D3.A -24.65,35.7 R9.2
N$8
  Top 0.2: MICRO-USB.D+ -5.9,4.05 R2.2
N$9
  Top 0.2: MICRO-USB.D- -4.5,3.4 -4.85,3.05 R3.2
N$15  (via drill 0.35)
  Top 0.2: R7.1 -17.95,-2.75 v-18.05,-2.85
  Bottom 0.2: v-18.05,-2.85 -18.05,-4.51 SENSOR.1
N$20
  Top 0.2: BAT_CHAR.5 2.8,-3.3 2.85,-3.25 2.85,-1.95 2.75,-1.85 R5.2
N$21
  Top 0.2: R4.1 -0.6,-3.25 BAT_CHAR.1
SENSOR  (via drill 0.35)
  Top 0.2: R6.1 -14.55,-2.25 -16.25,-3.95 v-16.25,-6.15
  Bottom 0.2: v-16.25,-6.15 -16.05,-6.35 -14.25,-6.35 SENSOR.3
SERVO  (via drill 0.35)
  Top 0.3: NRF52.P0.23 -9.47,22.13 v-10.65,20.95 | v-11.35,12.65 -11.35,13.95 -12.25,14.85 -12.25,18.95 v-11.95,19.25
  Bottom 0.3: J3.3 -14.15,9.85 v-11.35,12.65 | v-11.95,19.25 -10.65,20.55 v-10.65,20.95
SWDCLK  (via drill 0.4)
  Top 0.2: v-21.75,31.35 -21.55,31.35 -18.25,34.65 NRF52.SWDCLK | TC2.1 -25.01,31.99 v-25.45,31.55
  Bottom 0.2: v-25.45,31.55 -25.25,31.35 v-21.75,31.35
SWDIO
  Top 0.2: NRF52.SWDIO -18.35,35.75 -22.11,31.99 TC2.2
VBAT  (via drill 0.35, 0.4)
  Top 0.4: BAT_CHAR.3 -0.6,-5.25 -4.65,-5.25 -5.85,-6.45 -6.75,-6.45 -7.25,-5.95 -7.25,-4.95 -12.05,-0.15 | J1.1 -12.05,-0.15 | -12.05,-0.15 v-12.05,7.25 | v-11.05,11.15 -10,12.2 -9.95,12.2 -9.95,15.65 | v-9.95,19.35 -9.95,15.65 | Q3.3 -10.05,15.75 -9.95,15.65 | R1.2 -0.9,23 v-0.45,22.55
  Bottom 0.4: v-12.05,7.25 -12.05,10.15 v-11.05,11.15 | v-9.95,19.35 -8.85,20.45 -1.25,20.45 -0.45,21.25 v-0.45,22.55
VBUS  (via drill 0.35, 0.5)
  Top 0.3: NRF52.VBUS -13.87,21.63 -14.45,21.05 -14.45,18.75 v-13.75,18.05
  Top 0.4: MICRO-USB.VBUS -2.75,2.75 v-4.75,0.75 | -1.35,-6.15 -3.35,-6.15 v-3.45,-6.05 | LED1.A -2.35,-7.15 -1.35,-6.15 | BAT_CHAR.4 2.9,-5.2 2.95,-5.25 2.95,-6.15 | 2.95,-6.15 2.95,-6.45 2.35,-7.05 C10.1 | -1.35,-6.15 2.95,-6.15 | Q3.1 -13.75,17.2 v-13.75,18.05 | v-2.75,11.05 -2.75,10.35 -3.55,9.55 -4.55,9.55 | -4.55,9.55 -4.7,9.55 D6.A | -4.55,9.55 -5.2,8.9 R11.2 -8.4,8.9 -9.05,8.25 v-9.55,8.25
  Bottom 0.4: v-4.75,0.75 -5.65,1.65 | -5.65,1.65 -9.55,5.55 v-9.55,8.25 | -5.65,1.65 -6.65,0.65 -6.65,-2.85 v-3.45,-6.05 | v-13.75,18.05 -4.85,18.05 -3.55,16.75 -3.55,13.45 -2.25,12.15 -2.25,11.55 v-2.75,11.05
VCC  (via drill 0.35, 0.4)
  Top 0.2: TC2.6 -21.85,29.45 -21.65,29.25 v-21.65,29.15
  Top 0.3: -5.15,21.45 -5.05,21.45 | -5.05,21.45 JP1.2 | -5.15,21.45 v-7.75,21.45 -7.75,20.85 -8.55,20.05 | REG.5 -6.7,20.1 -6.65,20.15 arc-8 -5.15,21.45 | -8.55,20.05 -8.35,19.85 C6.1 | -8.55,20.05 v-13.65,20.05 | v-19.05,12.75 -19.96,11.84 -22.45,11.84 | -22.45,11.84 JP2.2 | -22.45,6.45 -22.45,11.84 | DRV8835.12 -22.44,2.54 -22.45,2.55 -22.45,3.5 C2.1 -22.45,3.6 -22.45,6.45 | R6.2 -16.85,0 | -16.85,0 R7.2 -17.95,1.95 -22.45,6.45 | v-16.75,-1.35 -16.75,-0.1 -16.85,0 | NRF52.VDD -5.07,23.28 C4.1 -5.1,21.5 -5.05,21.45
  Bottom 0.3: v-7.75,21.45 -10.45,24.15 -17.45,24.15 -21.65,28.35 v-21.65,29.15 | v-13.65,20.05 -19.05,14.65 v-19.05,12.75 | SENSOR.4 -16.75,-5.01 v-16.75,-1.35
VDIV
  Top 0.2: R13.2 -2.25,24.3 | -2.25,24.3 R1.1 | NRF52.P0.05 -2.65,28.05 -2.35,27.75 -2.35,24.4 -2.25,24.3
VPOW  (via drill 0.35)
  Top 0.4: D6.C -6.85,13.3 C1.1 | K1.1 -0.09,11.09 -2.3,13.3 D6.C | Q3.2 -14,14.8 -14.05,14.75 -12.03,12.73 -12.03,11.13 -11.34,10.45 -10.76,10.45 -10.75,10.45 v-9.75,10.45 | v-5.35,14.65 -4.75,14.05 D6.C
  Bottom 0.4: v-9.75,10.45 -9.75,11.15 -6.25,14.65 v-5.35,14.65
VSUPL  (via drill 0.35)
  Top 0.3: DRV8835.1 -22.44,-1.85 | -22.44,-1.85 -22.44,-2.54 -22.95,-3.05 v-24.05,-3.05 | C3.1 -22.44,-1.85
  Top 0.4: REG.1 -6.7,15.6 | v-8.55,16.35 C5.1 -7.95,15.6 -6.7,15.6 | REG.3 -3.49,15.61 | -3.49,15.61 -3.29,15.41 K1.2 | -6.7,15.6 -3.5,15.6 -3.49,15.61
  Bottom 0.4: v-8.55,16.35 -9.25,16.35 -15.85,9.75 -15.85,5.85 | -15.85,5.85 -24.05,-2.35 v-24.05,-3.05 | J3.2 -14.79,4.79 -15.85,5.85